# Altium schematic sheet Sensor.SchDoc
size A3
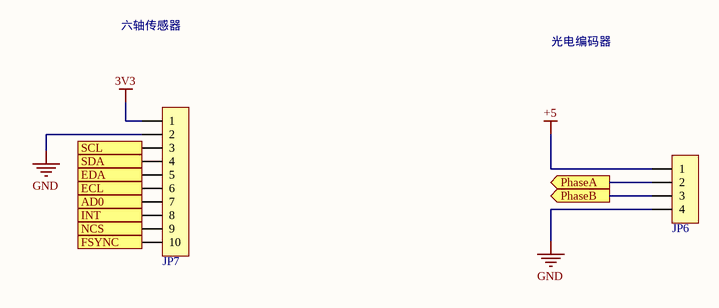
[diagram p0: Sensor.SchDoc]

## Parts
JP6  HDR-1X4  [KF350-4P]  (value not drawn)
JP7  HDR-1X10  [HDR2.54-LI-10P]  (value not drawn)

## Ports
AD0 (in), ECL (out), EDA (out), FSYNC (in), INT (in), NCS (in), PhaseA (out), PhaseB (out), SCL (in), SDA (in)

## Nets
3V3: JP7.1
+5: JP6.1
GND: JP6.4 JP7.2
AD0: JP7.7 ; port AD0
ECL: JP7.6 ; port ECL
EDA: JP7.5 ; port EDA
FSYNC: JP7.10 ; port FSYNC
INT: JP7.8 ; port INT
NCS: JP7.9 ; port NCS
PhaseA: JP6.2 ; port PhaseA
PhaseB: JP6.3 ; port PhaseB
SCL: JP7.3 ; port SCL
SDA: JP7.4 ; port SDA

## Notes on the sheet
- 六轴传感器
- 光电编码器

## Library data of the parts
JP6 = Header 4: 4P接插件; 版权归属: 源创客; BOM名称: 4P接插件; 学习资源: www.ooocke.com
JP7 = Header 10: 10P接插件; 版权归属: 源创客; BOM名称: 10P接插件; 学习资源: www.ooocke.com